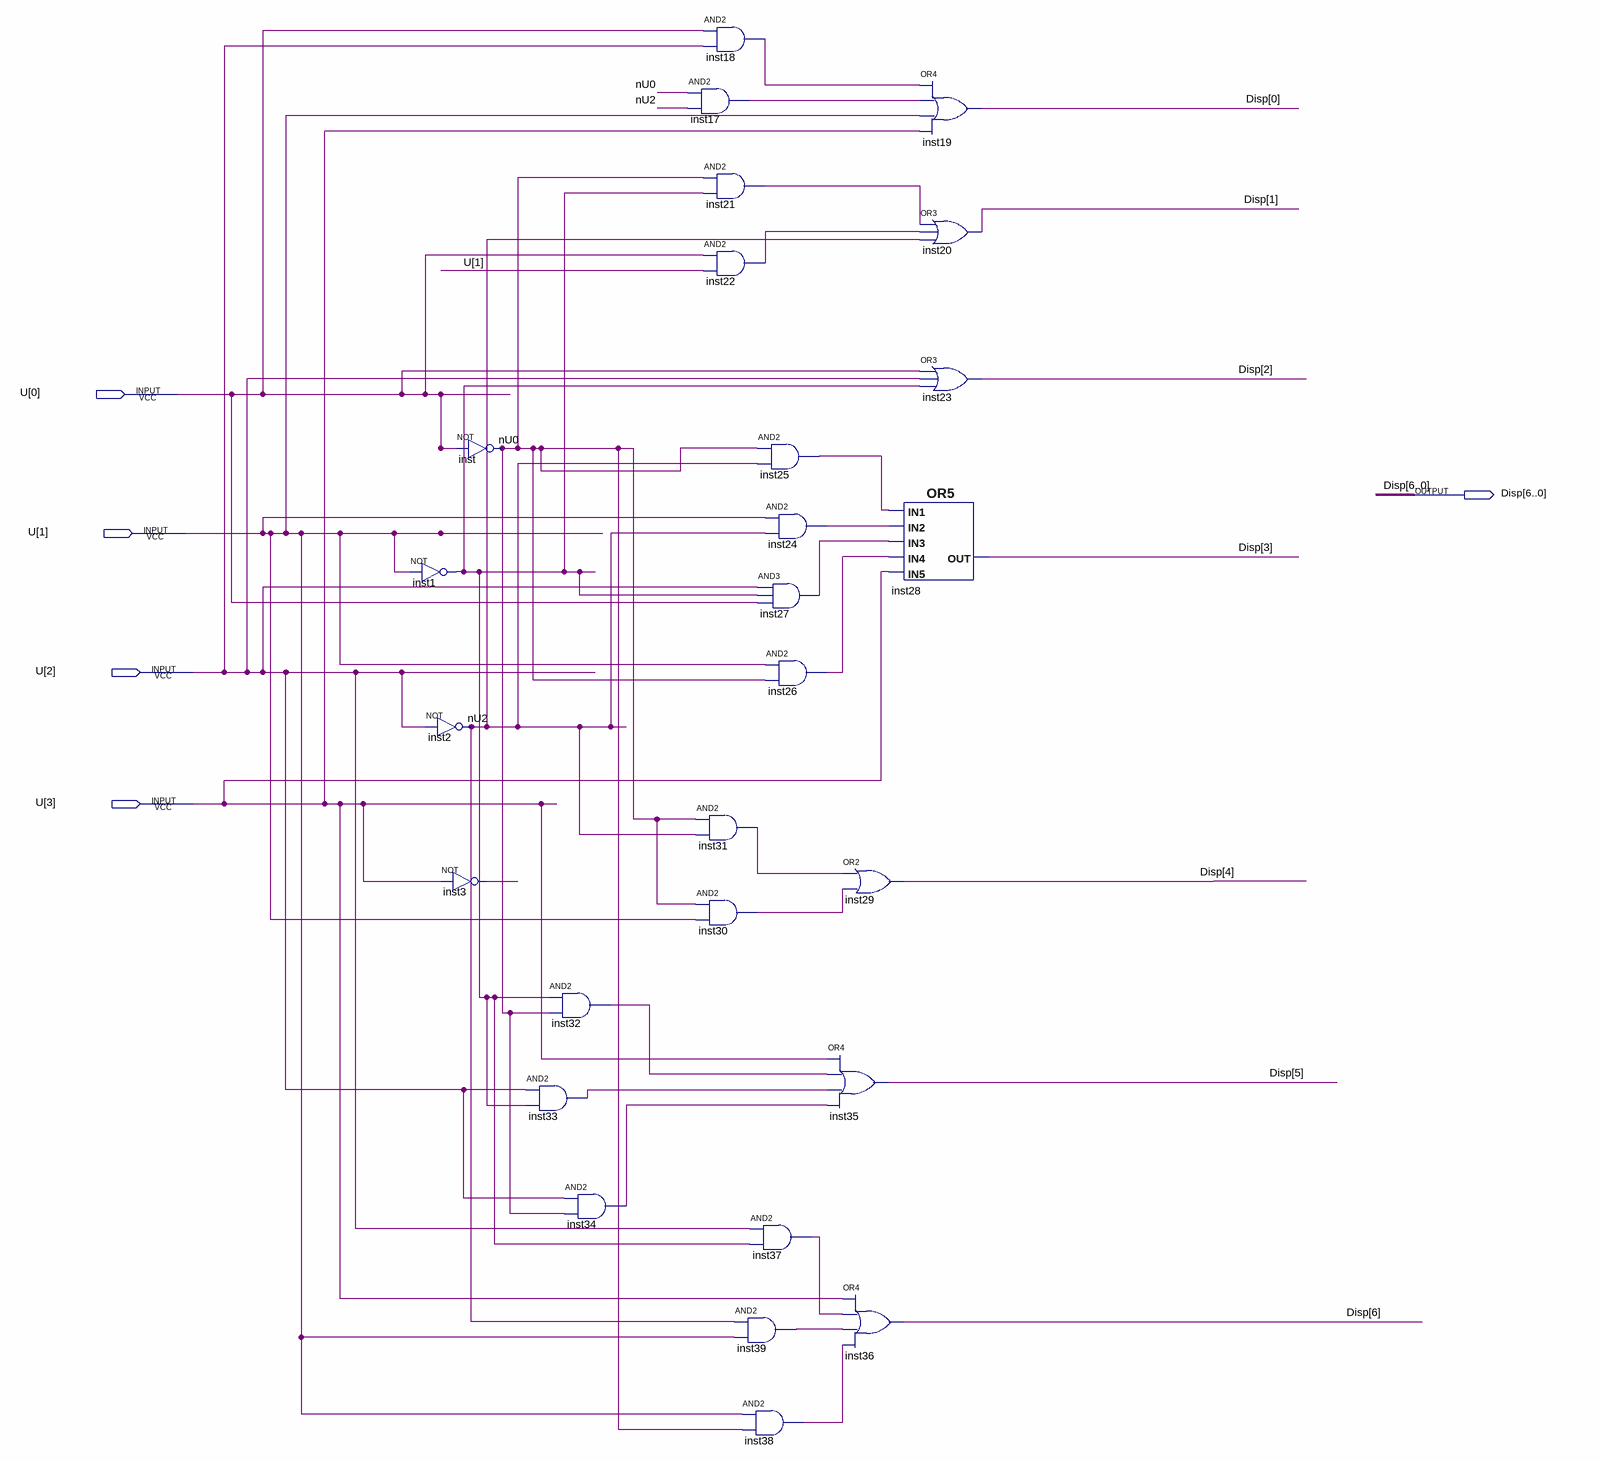
[diagram p0: schematic sheet]
// Quartus schematic decodificador.bdf as structural Verilog: 27 symbols, 5 pins
module decodificador (
  input  [3:0] U,
  output [6:0] Disp
);

  wire inst1_out, inst3_out, inst17_out, inst18_out, inst21_out, inst22_out, inst24_out, inst25_out,
       inst26_out, inst27_out, inst30_out, inst31_out, inst32_out, inst33_out, inst34_out, inst37_out,
       inst38_out, inst39_out, nU0, nU2;

  not inst1 (inst1_out, U[1]);
  not inst2 (nU2, U[2]);
  not inst3 (inst3_out, U[3]);
  not inst (nU0, U[0]);
  and inst32 (inst32_out, inst1_out, nU0);
  and inst33 (inst33_out, U[2], inst1_out);
  and inst34 (inst34_out, U[2], nU0);
  and inst17 (inst17_out, nU0, nU2);
  and inst31 (inst31_out, nU0, nU2);
  and inst30 (inst30_out, nU0, U[1]);
  and inst18 (inst18_out, U[0], U[2]);
  and inst21 (inst21_out, nU0, inst1_out);
  and inst22 (inst22_out, U[0], U[1]);
  and inst25 (inst25_out, nU0, nU2);
  and inst27 (inst27_out, U[2], inst1_out, U[0]);
  and inst37 (inst37_out, U[2], inst1_out);
  and inst39 (inst39_out, nU2, U[1]);
  and inst38 (inst38_out, U[1], nU0);
  and inst24 (inst24_out, U[1], nU2);
  and inst26 (inst26_out, U[1], nU0);
  or inst29 (Disp[4], inst31_out, inst30_out);
  or inst35 (Disp[5], U[3], inst32_out, inst33_out, inst34_out);
  or inst36 (Disp[6], U[3], inst37_out, inst39_out, inst38_out);
  or inst19 (Disp[0], inst18_out, inst17_out, U[1], U[3]);
  or inst20 (Disp[1], inst21_out, inst22_out, nU2);
  or inst23 (Disp[2], U[0], U[2], inst1_out);
  or inst28 (Disp[3], inst25_out, inst24_out, inst27_out, inst26_out, U[3]);
endmodule
